# Altium schematic sheet ESP32.SchDoc
size B
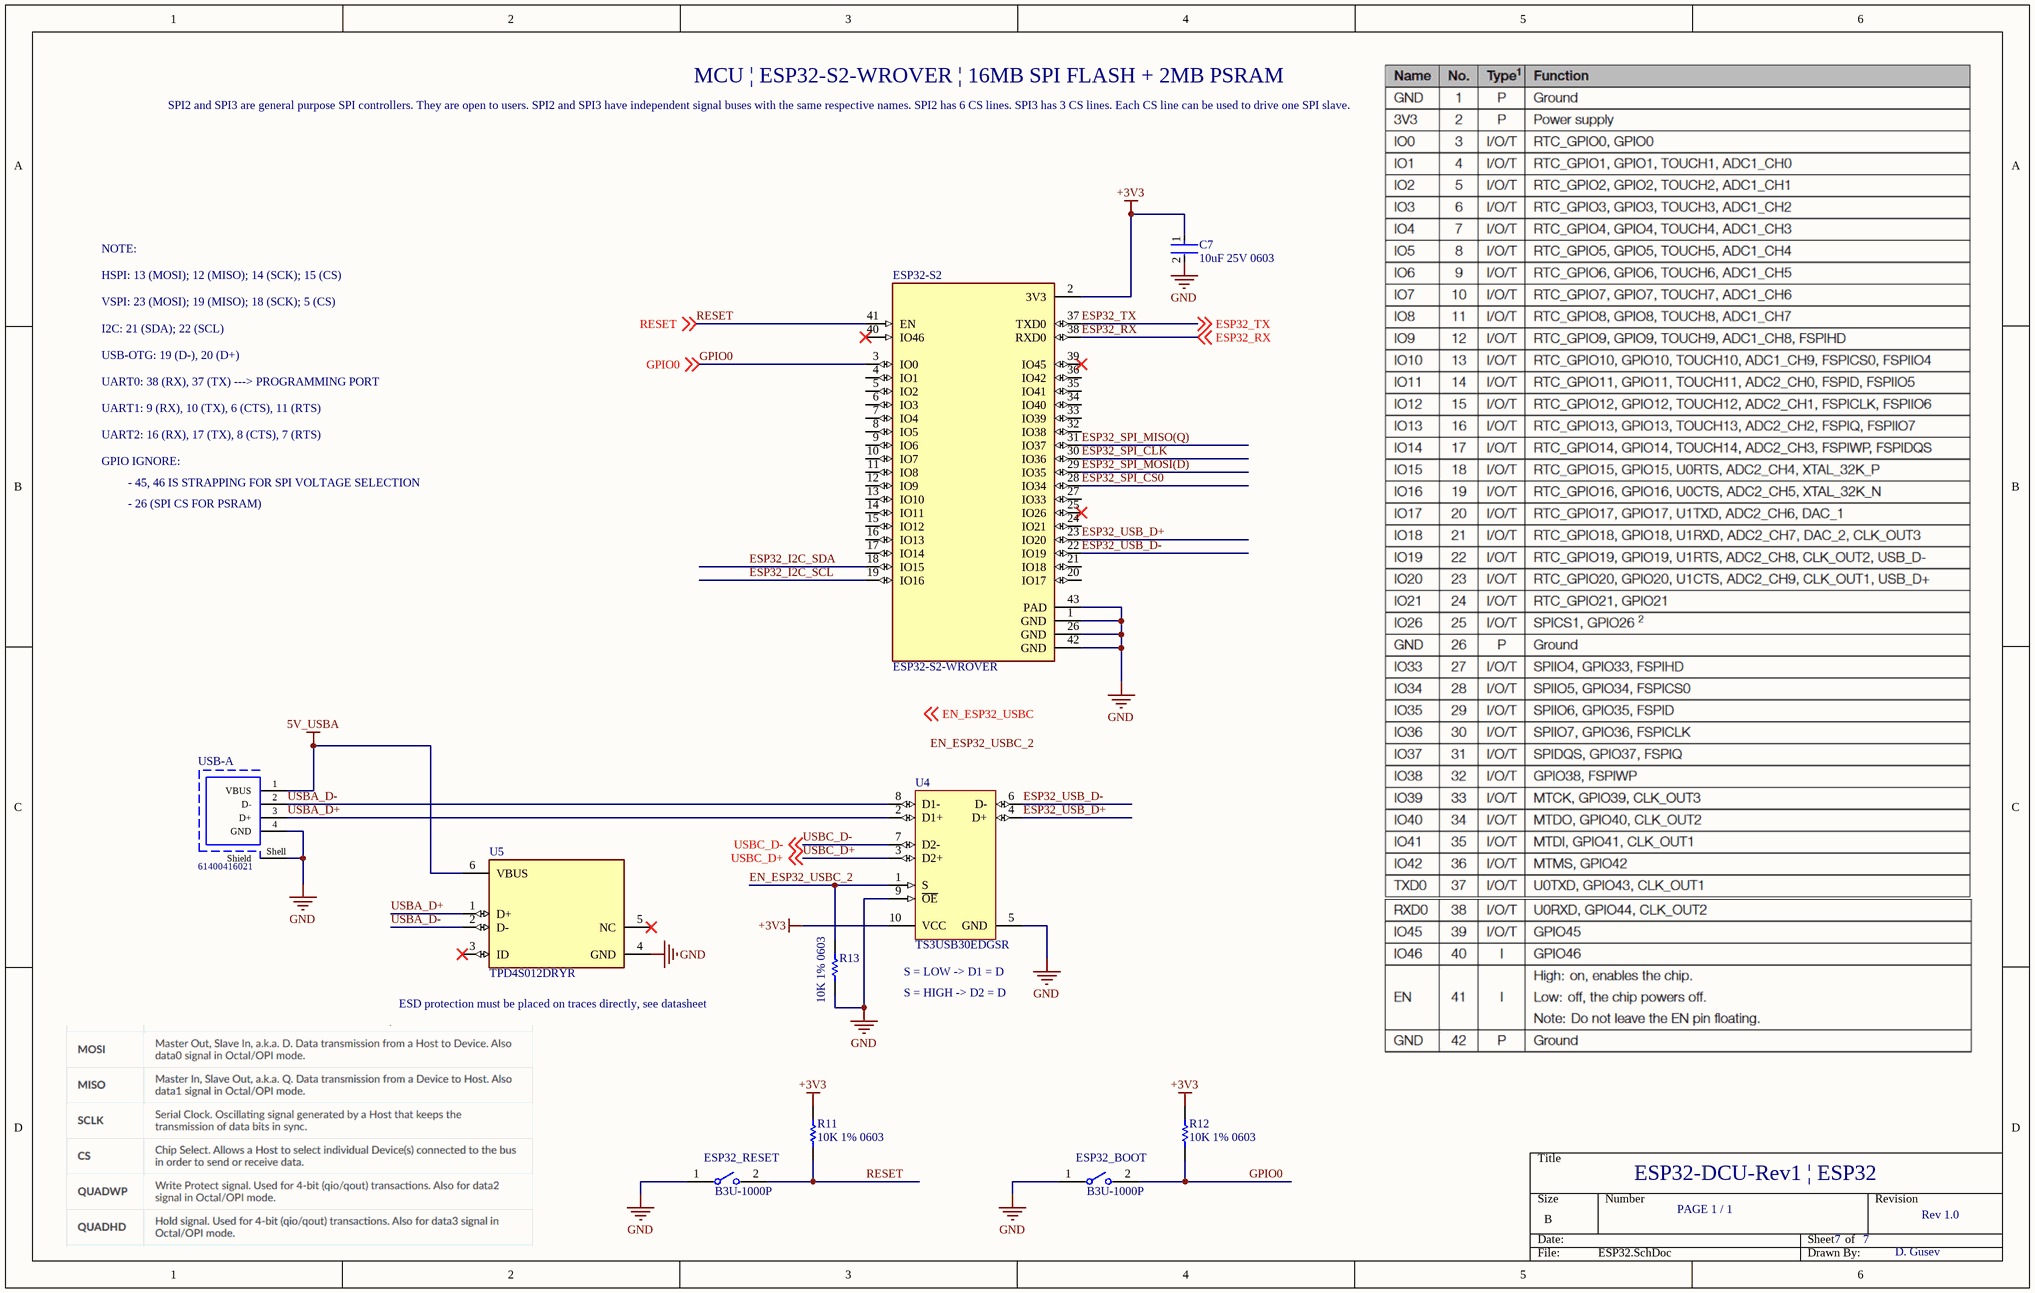
[diagram p0: ESP32.SchDoc]

## Parts
C7  10uF 25V 0603  [FP-C1608-080-IPC_A]
ESP32-S2  ESP32-S2-WROVER  [MODULE_ESP32-S2-WROVER]
ESP32_BOOT  B3U-1000P  [FP-B3U-1000P-MFG]
ESP32_RESET  B3U-1000P  [FP-B3U-1000P-MFG]
R11  10K 1% 0603  [RESC2013X70X40ML20T20]
R12  10K 1% 0603  [RESC2013X70X40ML20T20]
R13  10K 1% 0603  [RESC2013X70X40ML20T20]
U4  TS3USB30EDGSR  [DGS0010A_N]
U5  TPD4S012DRYR  [FP-DRY0006A-MFG]
USB-A  61400416021  [61400416021]

## Nets
5V_USBA: U5.6(VBUS) USB-A.1(VBUS)
+3V3: C7.1 ESP32-S2.2(3V3) R11.1 R12.1 U4.10(VCC)
GND: C7.2 ESP32-S2.1(GND) ESP32-S2.26(GND) ESP32-S2.42(GND) ESP32-S2.43(PAD) ESP32_BOOT.1 ESP32_RESET.1 R13.2 U4.5(GND) U4.9(~{OE}) U5.4(GND) USB-A.4(GND) USB-A.Shell(Shield)
EN_ESP32_USBC_2: R13.1 U4.1(S)
ESP32_I2C_SCL: ESP32-S2.19(IO16)
ESP32_I2C_SDA: ESP32-S2.18(IO15)
ESP32_RX: ESP32-S2.38(RXD0) ; off-sheet ESP32_RX
ESP32_SPI_CLK: ESP32-S2.30(IO36)
ESP32_SPI_CS0: ESP32-S2.28(IO34)
ESP32_SPI_MISO(Q): ESP32-S2.31(IO37)
ESP32_SPI_MOSI(D): ESP32-S2.29(IO35)
ESP32_TX: ESP32-S2.37(TXD0) ; off-sheet ESP32_TX
ESP32_USB_D+: ESP32-S2.23(IO20) U4.4(D+)
ESP32_USB_D-: ESP32-S2.22(IO19) U4.6(D-)
GPIO0: ESP32-S2.3(IO0) ESP32_BOOT.2 R12.2 ; off-sheet GPIO0
RESET: ESP32-S2.41(EN) ESP32_RESET.2 R11.2 ; off-sheet RESET
USBA_D+: U4.2(D1+) U5.1(D+) USB-A.3(D+)
USBA_D-: U4.8(D1-) U5.2(D-) USB-A.2(D-)
USBC_D+: U4.3(D2+) ; off-sheet USBC_D+
USBC_D-: U4.7(D2-) ; off-sheet USBC_D-

Not connected (* = marked no-connect by the designer): ESP32-S2 4(IO1) 5(IO2) 6(IO3) 7(IO4) 8(IO5) 9(IO6) 10(IO7) 11(IO8) 12(IO9) 13(IO10) 14(IO11) 15(IO12) 16(IO13) 17(IO14) 20(IO17) 21(IO18) 24(IO21) 25(IO26)* 27(IO33) 32(IO38) 33(IO39) 34(IO40) 35(IO41) 36(IO42) 39(IO45)* 40(IO46)*; U5 3(ID)* 5(NC)*

## Notes on the sheet
- MCU | ESP32-S2-WROVER | 16MB SPI FLASH + 2MB PSRAM
- SPI2 and SPI3 are general purpose SPI controllers. They are open to users. SPI2 and SPI3 have independent signal buses with the same respective names. SPI2 has 6 CS lines. SPI3 has 3 CS lines. Each CS line can be used to drive one SPI slave.
- NOTE:
- HSPI: 13 (MOSI); 12 (MISO); 14 (SCK); 15 (CS)
- VSPI: 23 (MOSI); 19 (MISO); 18 (SCK); 5 (CS)
- I2C: 21 (SDA); 22 (SCL)
- USB-OTG: 19 (D-), 20 (D+)
- UART0: 38 (RX), 37 (TX) ---> PROGRAMMING PORT
- UART1: 9 (RX), 10 (TX), 6 (CTS), 11 (RTS)
- UART2: 16 (RX), 17 (TX), 8 (CTS), 7 (RTS)
- GPIO IGNORE:
- - 45, 46 IS STRAPPING FOR SPI VOLTAGE SELECTION
- - 26 (SPI CS FOR PSRAM)
- (near U4) S = LOW -> D1 = D
- ESD protection must be placed on traces directly, see datasheet
- S = HIGH -> D2 = D
- ESP32-DCU-Rev1 | ESP32
- PAGE 1 / 1
- 7
- Rev 1.0
- D. Gusev
- Labels drawn without touching a wire or pin: EN_ESP32_USBC, EN_ESP32_USBC_2

## Library data of the parts
C7 = CMP-2000-05442-2: CAP CER 10UF 25V X5R 0603; Dielectric Material: Ceramic; Tolerance: 20%; Dielectric: X5R; Length: 1.6mm; Termination: SMD/SMT; Depth: 0.8mm; RoHS Compliant: Yes; Construction: Flat; Weight: 7.1E-05oz; Thickness: 0.039inch; Packaging: Tape and Reel; Min Operating Temperature: -55°C; Case Code (Imperial): 0603; Case/Package: 0603; Height: 0.8mm; Case Code (Metric): 1608; Voltage Rating: 25V; Resistor Type: Ceramic; Voltage Rating (DC): 25V; Max Operating Temperature: 85°C; REACH SVHC: No SVHC; Lead Free: Lead Free; Series: C; Width: 0.8mm; Mount: Surface Mount; Package Quantity: 1; Capacitance: 10uF
ESP32-S2 = ESP32-S2-WROVER: WiFi 802.11b/g/n Transceiver Module 2.4GHz PCB Trace Surface Mount; MF: Espressif Systems; Check_prices: https://www.snapeda.com/parts/ESP32-S2-WROVER/Espressif%20Systems/view-part/4614060/?ref=eda; SnapEDA_Link: https://www.snapeda.com/parts/ESP32-S2-WROVER/Espressif%20Systems/view-part/4614060/?ref=snap; Value: *; MP: ESP32-S2-WROVER; Package: None; Price: None; Availability: In Stock
ESP32_BOOT ESP32_RESET = CMP-2100-03586-2: SWITCH TACTILE SPST-NO 0.05A 12V; Contact Resistance: 100mR; Operating Force: 1.5N; Max Current Rating: 50mA; Switch Travel: 0.15mm; Actuator Type: Standard; Mechanical Life: 200000Cycles; Ratings: Dust Proof; Illumination Type: Non-Illuminated; Throw Configuration: SPST; Actuator Length: 0.4mm; Switch Function: Off-Mom; Height: 1.2mm; Width: 3mm; Weight: 0.000776oz; Contact Material: Silver; Max Voltage Rating (DC): 12V; Insulation Resistance: 100MR; Lead Free: Lead Free; Current Rating: 50mA; Termination: SMD/SMT; Length: 4mm; Voltage Rating (DC): 12V; Contact Current Rating: 50mA; Orientation: Straight; Depth: 2.5mm; Max Operating Temperature: 70°C; Packaging: Tape and Reel; Min Operating Temperature: -25°C; Package Quantity: 1; Mount: Surface Mount; Electrical Life: 200000Cycles
R11-R13 = CMP-2001-04376-1: Manufacturer: Panasonic; Part Number: ERJ-6ENF1002V
U4 = CMP-0309-00091-2: High-Speed USB 2.0 (480-Mbps) 1:2 Multiplexer / Demultiplexer Switch with Single, 10 ohm RON, 3.0 to 4.3V, -40 to 85 degC, 10-Pin MSOP (DGS), Green (RoHS & no Sb/Br); Manufacturer: Texas Instruments; Architecture: "1","2 mux/demux"; tpd max(ns): 0.25; ICC(uA): 1; IL OFF(Max)(nA): 2; OFF Time(Max)(ns): 30; SubFamily: USB Switch; ESD HBM(kV): +/-8; Bandwidth(MHz): 900; RON Mis-match(Max)(Ohms): 0.35; ON Time(Max)(ns): 25; ron(max)(ohms): 10; PartNumber: TS3USB30EDGSR; ComponentLink1URL: http://www.ti.com/general/docs/lit/getliterature.tsp?genericPartNumber=TS3USB30E&fileType=pdf; Vcc range(V): 3.0 to 4.3; PackageReference: DGS0010A; Code_JEDEC: MO-187-BA; PackageDescription: 10-Pin Thin Shrink Small Outline Package 0.5 mm Pitch; Eco-Plan: Green (RoHS & no Sb/Br); ComponentLink2URL: http://www.ti.com/litv/pdf/mpds035b; Number of Channels: 2; Mounting Technology: Surface Mount; PackageVersion: revC, Feb-2004; DatasheetVersion: SCDS255D; ComponentLink1Description: Datasheet; ComponentLink2Description: Package Specification; RON Flatness(Max)(Ohms): 2
U5 = CMP-0326-00038-4: TVS DIODE 5.5V 6SON; Breakdown Voltage: 24V; Interface: USB; ESD Protection: Yes; Peak Pulse Power: 60W; Number of Circuits: 4; Polarity: Unidirectional; Capacitance: 15pF; Test Current: 1mA; Working Voltage: 19V; Min Breakdown Voltage: 6V; Peak Pulse Current: 3A; Operating Supply Voltage: 950mV; Max Operating Temperature: 85°C; Packaging: Tape and Reel; Termination: SMD/SMT; Number of Pins: 6; Radiation Hardening: No; Width: 1.05mm; REACH SVHC: No SVHC; Lead Free: Lead Free; Depth: 1mm; Package Quantity: 5000; Length: 1.45mm; Direction: Unidirectional; Min Operating Temperature: -40°C; Number of Channels: 4; Max Power Dissipation: 60W; Height: 0.55mm
USB-A = CMP-1502-03227-1: USB 2.0 Type A Receptacle WR-COM, Horizontal, THT; Manufacturer: Wurth Elektronik; Working Voltage: 30VAC; Rated Current: 1.5A; Contact Resistance: 20mOhm; Manufacturer URL: http://www.we-online.de; Publisher: WurthElektronik; Packaging: Tray; Operating Temperature: -40to105degC; Orientation: Horizontal; Mounting Technology: THT; Part Number: 61400416021; Gender: Receptacle; Package Reference: 61400416021; Connector Type: USB2.0TypeA; Datasheet URL: https://katalog.we-online.de/em/datasheet/61400416021.pdf